# EAGLE design blinkm2neo_5Jul2020_isp (EAGLE 9.6.2)
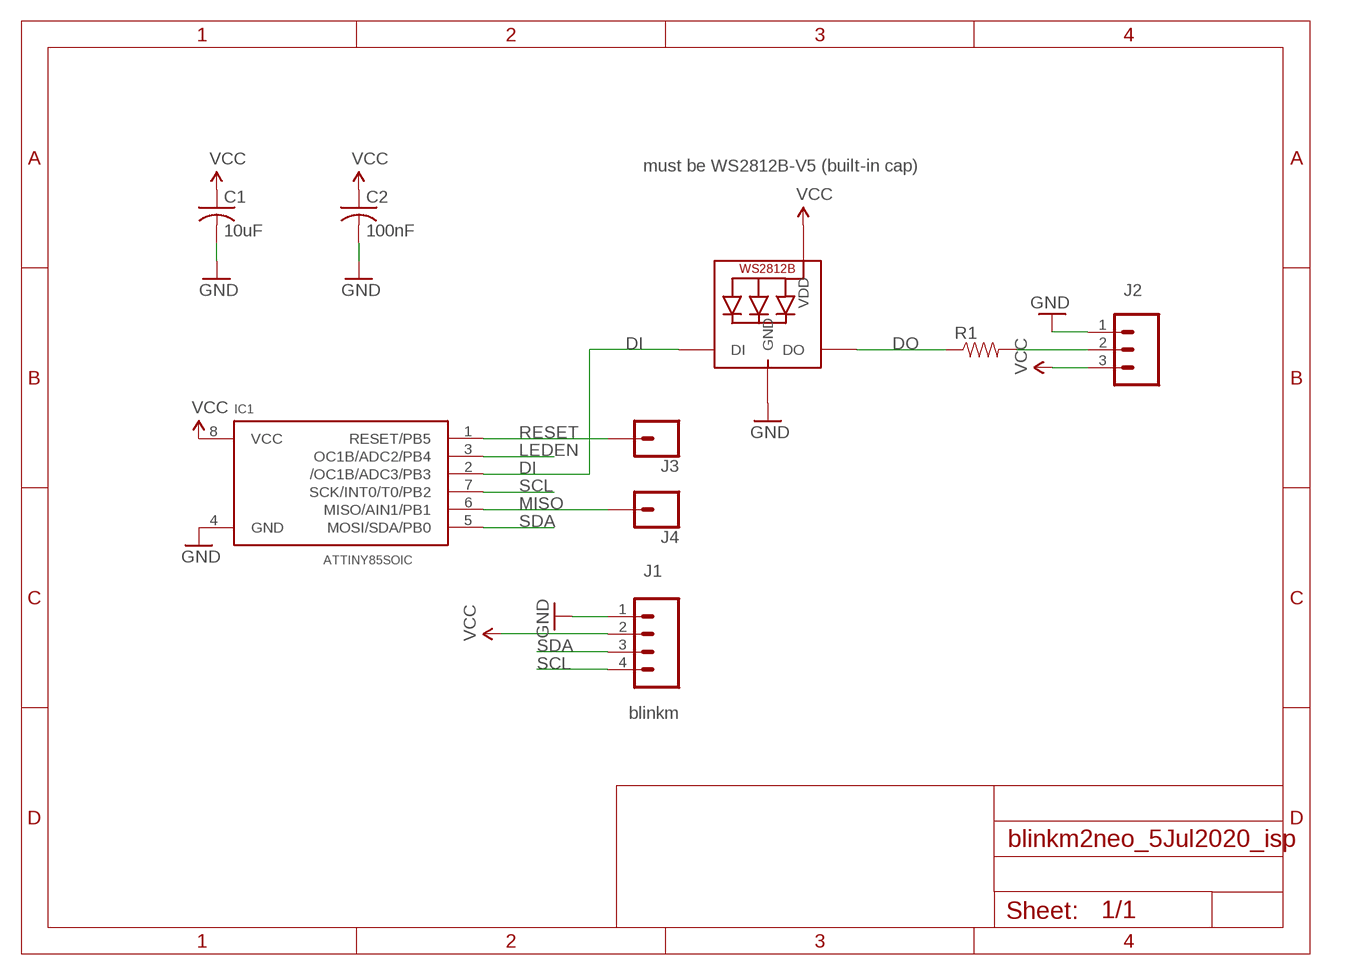
[diagram p0: schematic, sheet 1]

## Parts
C1  10uF  C-USC0402  [C0402]
C2  100nF  C-USC0402  [C0402]
IC1  ATTINY85SOIC  ATTINY45SOIC  [SO08-EIAJ]
J1  blinkm  CONN_04  [1X04]
J2  CONN_03  [1X03]
J3  CONN_01PTH_NO_SILK_YES_STOP  [1X01_NO_SILK]
J4  CONN_01PTH_NO_SILK_YES_STOP  [1X01_NO_SILK]
LED1  WS2812B-V5  WS2812B5050  [WS2812B]
R1  RESISTOR0402  [0402]

## Nets
DI: IC1.2(/OC1B/ADC3/PB3) LED1.4-DIN(DI)
DO: LED1.2-DOUT(DO) R1.1
GND: C1.2 C2.2 IC1.4(GND) J1.1 J2.1 LED1.3-GND(GND)
LEDEN: IC1.3(OC1B/ADC2/PB4)
MISO: IC1.6(MISO/AIN1/PB1) J4.1
N$1: J2.2 R1.2
RESET: IC1.1(RESET/PB5) J3.1
SCL: IC1.7(SCK/INT0/T0/PB2) J1.4
SDA: IC1.5(MOSI/SDA/PB0) J1.3
VCC: C1.1 C2.1 IC1.8(VCC) J1.2 J2.3 LED1.1-VDD(VDD)

## Notes on the sheet
- must be WS2812B-V5 (built-in cap)

## Library data of the parts
C1 C2 = rcl:C-US: CAPACITOR, American symbol; SPICEPREFIX: C
IC1 = todstuff:ATTINY45
J1 = SparkFun-Connectors:CONN_04: Multi connection point. Often used as Generic Header-pin footprint for 0.1 inch spaced/style header connections On any of the 0.1 inch spaced packages, you can populate with these: Break Away Headers - Straight <https://www.sparkfun.com/products/116> (PRT-00116) Break Away Male Headers - Right Angle <https://www.sparkfun.com/products/553> (PRT-00553) Female Headers <https://www.sparkfun.com/products/115> (PRT-00115) Break Away Headers - Machine Pin <https://www.sparkfun.com/products/117> (PRT-00117) Break Away Female Headers - Swiss Machine Pin <https://www.sparkfun.com/products/743> (PRT-00743) For SCREWTERMINALS and SPRING TERMINALS visit here: Screw Terimnals on SparkFun.com <https://www.sparkfun.com/search/results?term=Screw+Terminals> (5mm/3.5mm/2.54mm spacing) This device is also useful as a general connection point to wire up your design to another part of your project. Our various solder wires solder well into these plated through hole pads. Hook-Up Wire - Assortment (Stranded, 22 AWG) <https://www.sparkfun.com/products/11375> (PRT-11375) Hook-Up Wire - Assortment (Solid Core, 22 AWG) <https://www.sparkfun.com/products/11367> (PRT-11367) View the entire wire category on our website here <https://www.sparkfun.com/categories/141> Special notes: Molex polarized connector foot print use with SKU : PRT-08231 with associated crimp pins and housings. 1MM SMD Version SKU: PRT-10208; PROD_ID: CONN-09696
J2 = SparkFun-Connectors:CONN_03: Multi connection point. Often used as Generic Header-pin footprint for 0.1 inch spaced/style header connections On any of the 0.1 inch spaced packages, you can populate with these: Break Away Headers - Straight <https://www.sparkfun.com/products/116> (PRT-00116) Break Away Male Headers - Right Angle <https://www.sparkfun.com/products/553> (PRT-00553) Female Headers <https://www.sparkfun.com/products/115> (PRT-00115) Break Away Headers - Machine Pin <https://www.sparkfun.com/products/117> (PRT-00117) Break Away Female Headers - Swiss Machine Pin <https://www.sparkfun.com/products/743> (PRT-00743) Stackable Header - 3 Pin (Female, 0.1") <https://www.sparkfun.com/products/13875> (PRT-13875) For SCREWTERMINALS and SPRING TERMINALS visit here: Screw Terimnals on SparkFun.com <https://www.sparkfun.com/search/results?term=Screw+Terminals> (5mm/3.5mm/2.54mm spacing) This device is also useful as a general connection point to wire up your design to another part of your project. Our various solder wires solder well into these plated through hole pads. Hook-Up Wire - Assortment (Stranded, 22 AWG) <https://www.sparkfun.com/products/11375> (PRT-11375) Hook-Up Wire - Assortment (Solid Core, 22 AWG) <https://www.sparkfun.com/products/11367> (PRT-11367) View the entire wire category on our website here <https://www.sparkfun.com/categories/141> Special notes: Molex polarized connector foot print use with SKU : PRT-08232 with associated crimp pins and housings.
J3 J4 = SparkFun-Connectors:CONN_01: Single connection point. Often used as Generic Header-pin footprint for 0.1 inch spaced/style header connections On any of the 0.1 inch spaced packages, you can populate with these: Break Away Headers - Straight <https://www.sparkfun.com/products/116> (PRT-00116) Break Away Male Headers - Right Angle <https://www.sparkfun.com/products/553> (PRT-00553) Female Headers <https://www.sparkfun.com/products/115> (PRT-00115) Break Away Headers - Machine Pin <https://www.sparkfun.com/products/117> (PRT-00117) Break Away Female Headers - Swiss Machine Pin <https://www.sparkfun.com/products/743> (PRT-00743) This device is also useful as a general connection point to wire up your design to another part of your project. Our various solder wires solder well into these plated through hole pads. Hook-Up Wire - Assortment (Stranded, 22 AWG) <https://www.sparkfun.com/products/11375> (PRT-11375) Hook-Up Wire - Assortment (Solid Core, 22 AWG) <https://www.sparkfun.com/products/11367> (PRT-11367) View the entire wire category on our website here <https://www.sparkfun.com/categories/141> Special notes: SMTSO-256-ET is a "flush mount" nut for a 4-40 screw. We mostly use this on specialty testbeds; it is a nice way to connect hardware to your PCB at an adjustable hieght. Also note, the SNAP packages are for using a snappable style connector. We sell a baggie of snaps and they are also used on two LilyPad designs: Snap Assortment - 30 pack (male and female) <https://www.sparkfun.com/products/11347> (DEV-11347) LilyPad Arduino SimpleSnap <https://www.sparkfun.com/products/10941> (DEV-10941) LilyPad SimpleSnap Protoboard <https://www.sparkfun.com/products/10940> (DEV-10940)
LED1 = adafruit:WS2812B
R1 = SparkFun-Resistors:RESISTOR: Generic Resistor Package

## Board
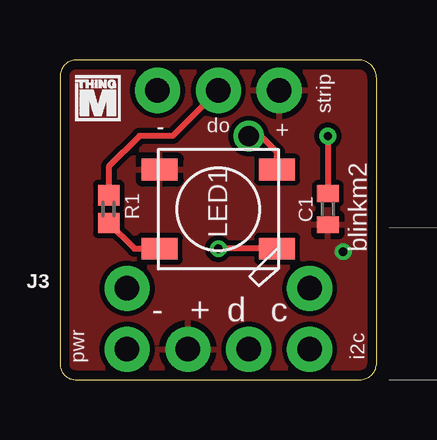
[diagram p1: board, top side]
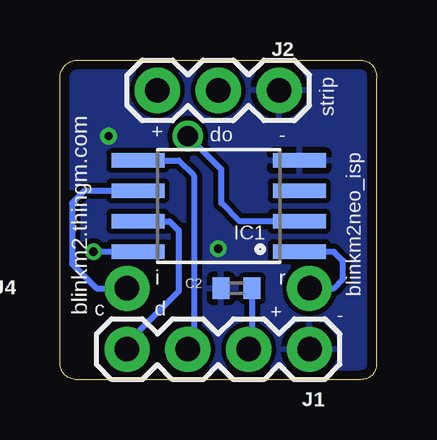
[diagram p2: board, bottom side, seen from below]

Size 13.21 x 13.34 mm. Coordinates in mm from the lower left corner, seen from the top.
Outline: 12.45,13.34 0.64,13.34 arc90 0,12.58 0,0.64 arc90 0.64,0 12.45,0 arc90 13.21,0.64 13.21,12.58 arc90 12.45,13.34
Copper layers (1*16): Top 0.0356mm / dielectric 0.9911mm / Bottom 0.0356mm
Design rules "LaenPCBOrder-tod *": minimum track width 10mil, minimum drill 13mil, track to track 8mil, track to pad 8mil, pad to pad 8mil, via to via 8mil, smd to smd 6mil, copper to edge 15mil, drill to drill 8mil, minimum pad ring 7mil, minimum via ring 7mil, stop-mask expansion 4mil, vias tented up to drill 25mil, thermal gap 10mil
vRestrict: area 4.2,5.3 to 6.1,7

### Footprints (pad centres in the part's own frame; a part is rotated, then mirrored left to right if it is on the bottom)
C0402 = smd 0.7 x 0.9: 1 -0.65,0; 2 0.65,0
SO08-EIAJ = smd 0.61 x 2.21: 1 -1.905,-3.378; 2 -0.635,-3.378; 3 0.635,-3.378; 4 1.905,-3.378; 5 1.905,3.353; 6 0.635,3.353; 7 -0.635,3.353; 8 -1.905,3.353
1X04 = drill 1.016 pad 1.88: 1 0,0; 2 2.54,0; 3 5.08,0; 4 7.62,0
1X03 = drill 1.016 pad 1.88: 1 0,0; 2 2.54,0; 3 5.08,0
1X01_NO_SILK = drill 1.016 pad 1.88: 1 0,0
WS2812B = smd 1.5 x 0.9: 1-VDD 2.45,-1.65; 2-DOUT 2.45,1.65; 3-GND -2.45,1.65; 4-DIN -2.45,-1.65
0402 = smd 0.85 x 0.9: 1 -0.58,0; 2 0.58,0

### Placement (x,y rotation side)
C1  11.18,7.11 90 top
C2  5.84,3.81 180 bottom
IC1  6.61,7.24 90 bottom
J1  2.8,1.27 180 bottom
J2  4.07,12.07 180 bottom
J3  2.8,3.81 0 top
J4  10.42,3.81 0 bottom
LED1  6.61,7.11 180 top
R1  2.03,7.11 90 top
U$1  [THINGM_LOGO_0.075IN]  0.64,10.8 0 top

### Tracks (layer width: path | path; a pad name or v marks a point on that pad's centre or on a via)
DI  (via drill 0.85)
  Top 0.254: LED1.4-DIN 9.06,9.49 8.38,10.16 v7.88,10.16
  Bottom 0.254: IC1.2 5.72,6.61 6.48,7.37 6.48,8.77 v7.88,10.16
DO
  Top 0.254: LED1.2-DOUT 3.3,5.46 3.1,5.46 R1.1
GND  (via drill 0.35)
  Top 0.254: LED1.3-GND v6.61,5.46 | v11.18,10.16 C1.2
  pour Bottom: 14.1,14.1 14.1,-1.27 -1.01,-1.27 -1.01,14.1
MISO
  Bottom 0.254: J4.1 11.69,3.81 12.7,4.83 12.7,7.37 12.19,7.88 IC1.6
N$1
  Top 0.254: R1.2 2.03,8.88 3.31,10.16 4.7,10.16 J2.2
RESET
  Bottom 0.254: J3.1 1.78,3.81 1.4,4.19 1.4,4.96 1.78,5.34 IC1.1
SCL
  Bottom 0.254: J1.4 10.42,1.53 8.26,3.69 8.26,6.23 8.64,6.61 IC1.7
SDA
  Bottom 0.254: J1.3 7.62,1.53 7.62,8.51 8.26,9.15 IC1.5
VCC  (via drill 0.35)
  Bottom 0.254: C2.1 5.19,1.41 J1.2 | IC1.8 v11.81,5.34
  pour Top: -0.63,13.97 13.59,13.97 13.59,-0.38 -0.63,-0.38

### Text on the board
tPlace: strip | - | do | + | blinkm2 | - | + | d | c | pwr | i2c
bPlace: strip | - | do | + | blinkm2.thingm.com | blinkm2neo_isp | r | i | + | d | c | -